# Altium schematic sheet Connector.SchDoc
size A4; SheetNumber: 5; SheetTotal: 5
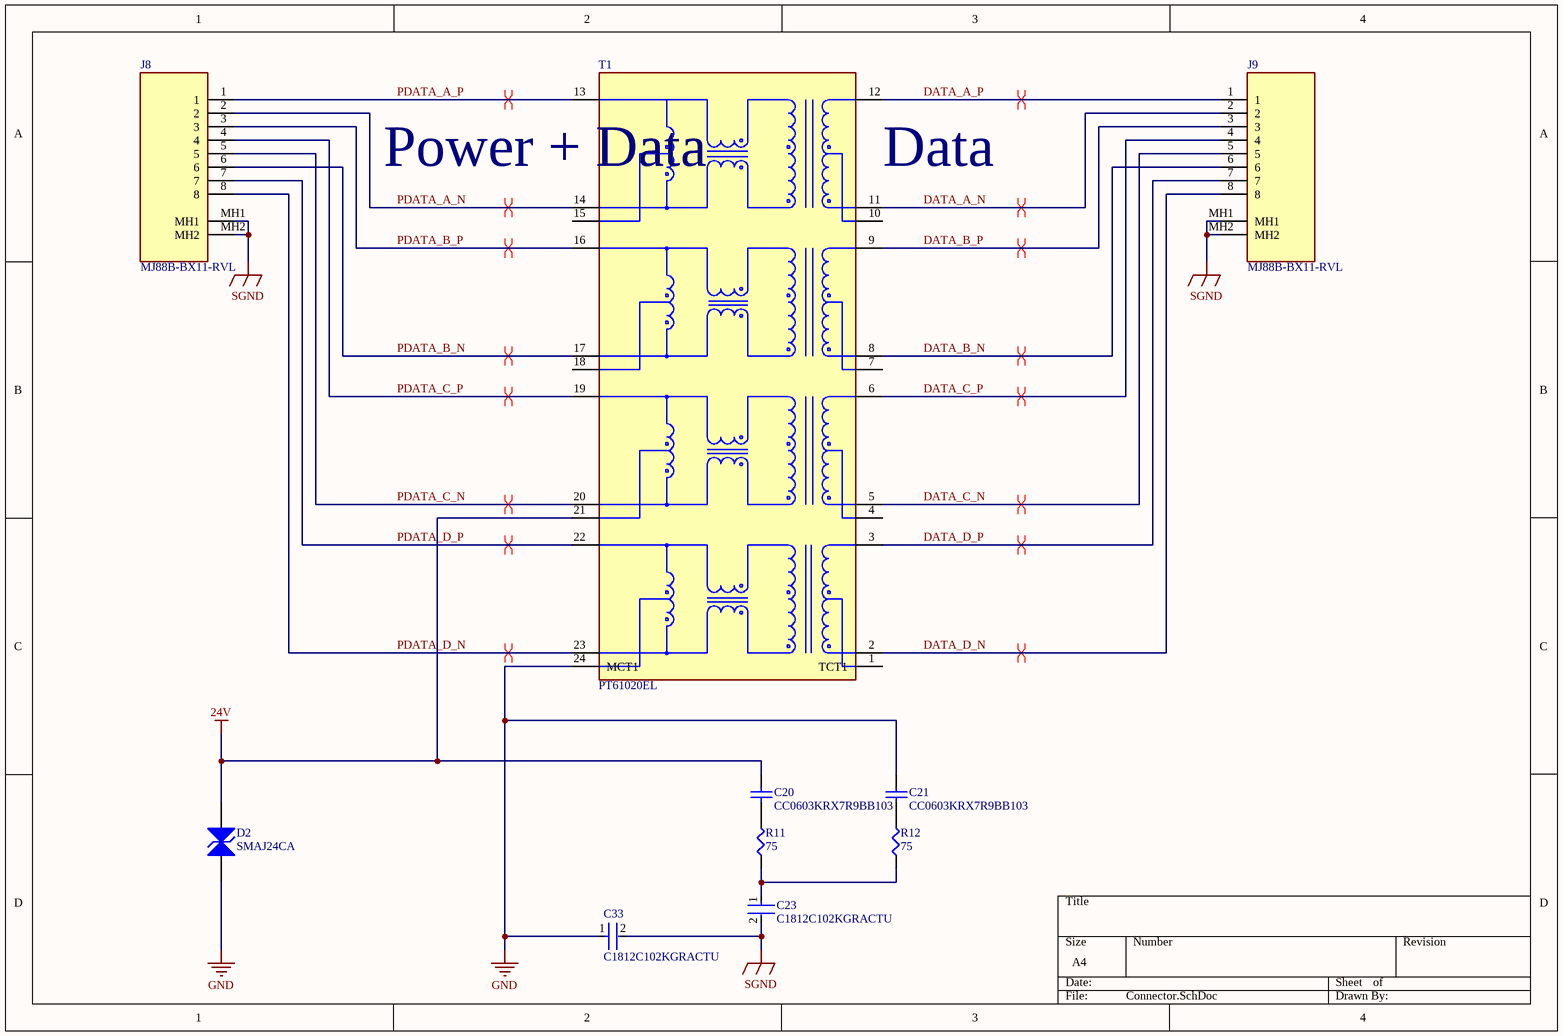
[diagram p0: Connector.SchDoc]

## Parts
C20  CC0603KRX7R9BB103  [CAPC1608X90X40ML10T20]
C21  CC0603KRX7R9BB103  [CAPC1608X90X40ML10T20]
C23  C1812C102KGRACTU  [FP-C1812C102KGRACTU-MFG]
C33  C1812C102KGRACTU  [FP-C1812C102KGRACTU-MFG]
D2  SMAJ24CA  [LFUS-DO-214AC-A-2_L]
J8  MJ88B-BX11-RVL  [MJ88B-BX11-RVL]
J9  MJ88B-BX11-RVL  [MJ88B-BX11-RVL]
R11  75  [SMD-0603-RES]
R12  75  [SMD-0603-RES]
T1  PT61020EL  [FP-PT61020EL-MFG]

## Nets
24V: C20.2 D2.2(A) T1.21(MCT2)
GND: C21.2 C33.1 D2.1(A) T1.24(MCT1)
SGND: C23.2 C33.2 J8.MH1 J8.MH2 J9.MH1 J9.MH2
DATA_A_N: J9.2 T1.11(TD4+)
DATA_A_P: J9.1 T1.12(TD4-)
DATA_B_N: J9.6 T1.8(TD3+)
DATA_B_P: J9.3 T1.9(TD3-)
DATA_C_N: J9.5 T1.5(TD2+)
DATA_C_P: J9.4 T1.6(TD2-)
DATA_D_N: J9.8 T1.2(TD1+)
DATA_D_P: J9.7 T1.3(TD1-)
PDATA_A_N: J8.2 T1.14(MX4+)
PDATA_A_P: J8.1 T1.13(MX4-)
PDATA_B_N: J8.6 T1.17(MX3+)
PDATA_B_P: J8.3 T1.16(MX3-)
PDATA_C_N: J8.5 T1.20(MX2+)
PDATA_C_P: J8.4 T1.19(MX2-)
PDATA_D_N: J8.8 T1.23(MX1+)
PDATA_D_P: J8.7 T1.22(MX1-)
NetC20_1: C20.1 R11.2
NetC21_1: C21.1 R12.2
NetC23_1: C23.1 R11.1 R12.1

Not connected (* = marked no-connect by the designer): T1 1(TCT1) 4(TCT2) 7(TCT3) 10(TCT4) 15(MCT4) 18(MCT3)

## Layout directives
differential pair: DATA_A_N, DATA_A_P, DATA_B_N, DATA_B_P, DATA_C_N, DATA_C_P, DATA_D_N, DATA_D_P, PDATA_A_N, PDATA_A_P, PDATA_B_N, PDATA_B_P, PDATA_C_N, PDATA_C_P, PDATA_D_N, PDATA_D_P

## Notes on the sheet
- (near T1) Power + Data
- (near T1) Data

## Library data of the parts
C20 C21 = CMP-2100-03600-1: Chip Capacitor, 10 nF, +/- 10%, 50 V, -55 to 125 degC, 0603 (1608 Metric), RoHS, Tape and Reel; Manufacturer: Yageo; Insulation Resistance: 100GR; Dielectric: X7R; Voltage Rating (DC): 50V; Capacitance: 10nF; Material: Ceramic; Lead Free: LeadFree; Case/Package: 0603; Datasheet Version: Rev. 15, 10/2016; Composition: Ceramic; Radiation Hardening: No; Thickness: 0.035inch; RoHSCompliant: True; Termination: SMD/SMT; Manufacturer URL: http://www.yageo.com/; Tolerance: 10%; REACH SVHC: NoSVHC; Voltage: 50V; Max Operating Temperature: 125degC; Case Code (Metric): 1608; Package Quantity: 1; Case Code (Imperial): 0603; Packaging: TapeandReel; Package Reference: 0603; Width: 0.031inch; Datasheet URL: http://www.yageo.com/documents/recent/UPY-GPHC_X7R_6.3V-to-50V_15.pdf; Length: 1.6mm; Min Operating Temperature: -55degC; Number of Pins: 2; Depth: 0.8mm; Mount: SurfaceMount; Height: 0.8mm; Voltage Rating: 50V; Package Description: 2-Pin Surface Mount Device, Body 1.6 x 0.8 mm
C23 C33 = CMP-2000-06032-2: CAP CER 1000PF 2KV X7R 1812
D2 = CMP-2000-07087-1: Transient Voltage Suppression Diode, 400 W, 24 V, -65 to 150 degC, 2-Pin SMD, RoHS, Tape and Reel; Manufacturer: Littelfuse; Power Dissipation: 400W; Directional: Bi-Directional; Breakdown Voltage-Min: 26.7V; Clamping Voltage-Max: 38.9V; Breakdown Voltage-Max: 29.5V; Mounting Technology: SurfaceMount; Datasheet URL: http://www.littelfuse.com/~/media/electronics/datasheets/tvs_diodes/littelfuse_tvs_diode_smaj_datasheet.pdf.pdf; Manufacturer URL: http://www.littelfuse.com/; Package Description: 2-Pin Surface Mount Device, Body 4.295 x 2.595 mm; Datasheet Version: 11/2015; Package Reference: DO-214AC
J8 J9 = MJ88B-BX11-RVL: Modular Jack, 8P8C, Straddle DIP
R11 R12 = ERJ-3EKF75R0V: RES SMD 75 OHM 1% 1/10W 0603; Manufacturer: Panasonic Electronic Components; Factory Stock: 0; Unit Price (USD): 0.00379; @ qty: 1500; Minimum Quantity: 1; Power (Watts): 0.1W, 1/10W; Temperature Coefficient: ±100ppm/°C; Part Number: ERJ-3EKF75R0V; Datasheets: http://industrial.panasonic.com/www-cgi/jvcr13pz.cgi?E+PZ+3+AOA0002+ERJ3EKF75R0V+7+WW; Image: //media.digikey.com/Photos/Panasonic%20Photos/MFG_ERJ-P6W%20Series.jpg; Digi-Key Part Number: P75.0HCT-ND; Quantity Available: 236923; Packaging: Cut Tape (CT); Series: ERJ; Part Status: Active; Value: 75; Tolerance: ±1%; Composition: Thick Film; Features: Automotive AEC-Q200; Operating Temperature: -55°C ~ 155°C; Package / Case: 0603 (1608 Metric); Supplier Device Package: 0603; Size / Dimension: 0.063" L x 0.031" W (1.60mm x 0.80mm); Height - Seated (Max): 0.022" (0.55mm); Number of Terminations: 2; Failure Rate: -
T1 = CMP-07264-000012-1: PULSE XFMR 1CT:1 350UH; Self Resonant Frequency: 100kHz; Insertion Loss: -1.1dB; Max DC Current: 8mA; Turns Ratio: 1:1; DC Resistance (DCR): 900mR; Max Frequency: 100MHz; Lead/Base Style: Gull Wing; Return Loss: -12dB; Min Frequency: 300kHz; Radiation Hardening: No; Mount: Surface Mount; REACH SVHC: No SVHC; Height: 6mm; Max Operating Temperature: 85°C; Inductance: 350uH; Min Operating Temperature: -40°C; Width: 16mm; RoHS Compliant: Yes; Package Quantity: 1; Packaging: Tape and Reel; Depth: 16mm; Length: 17.62mm; Number of Pins: 24; Series: *; Termination: SMD/SMT